# Altium schematic sheet HEADERS_JHAT.SchDoc: HEADERS JHAT
size A3; Author: Silvio Navaretti; CompanyName: ARDUINO; DrawnBy: Silvio Navaretti; Engineer: Silvio Navaretti; Organization: ARDUINO; SheetNumber: 20; SheetTotal: 51; RevAuthor: Silvio Navaretti
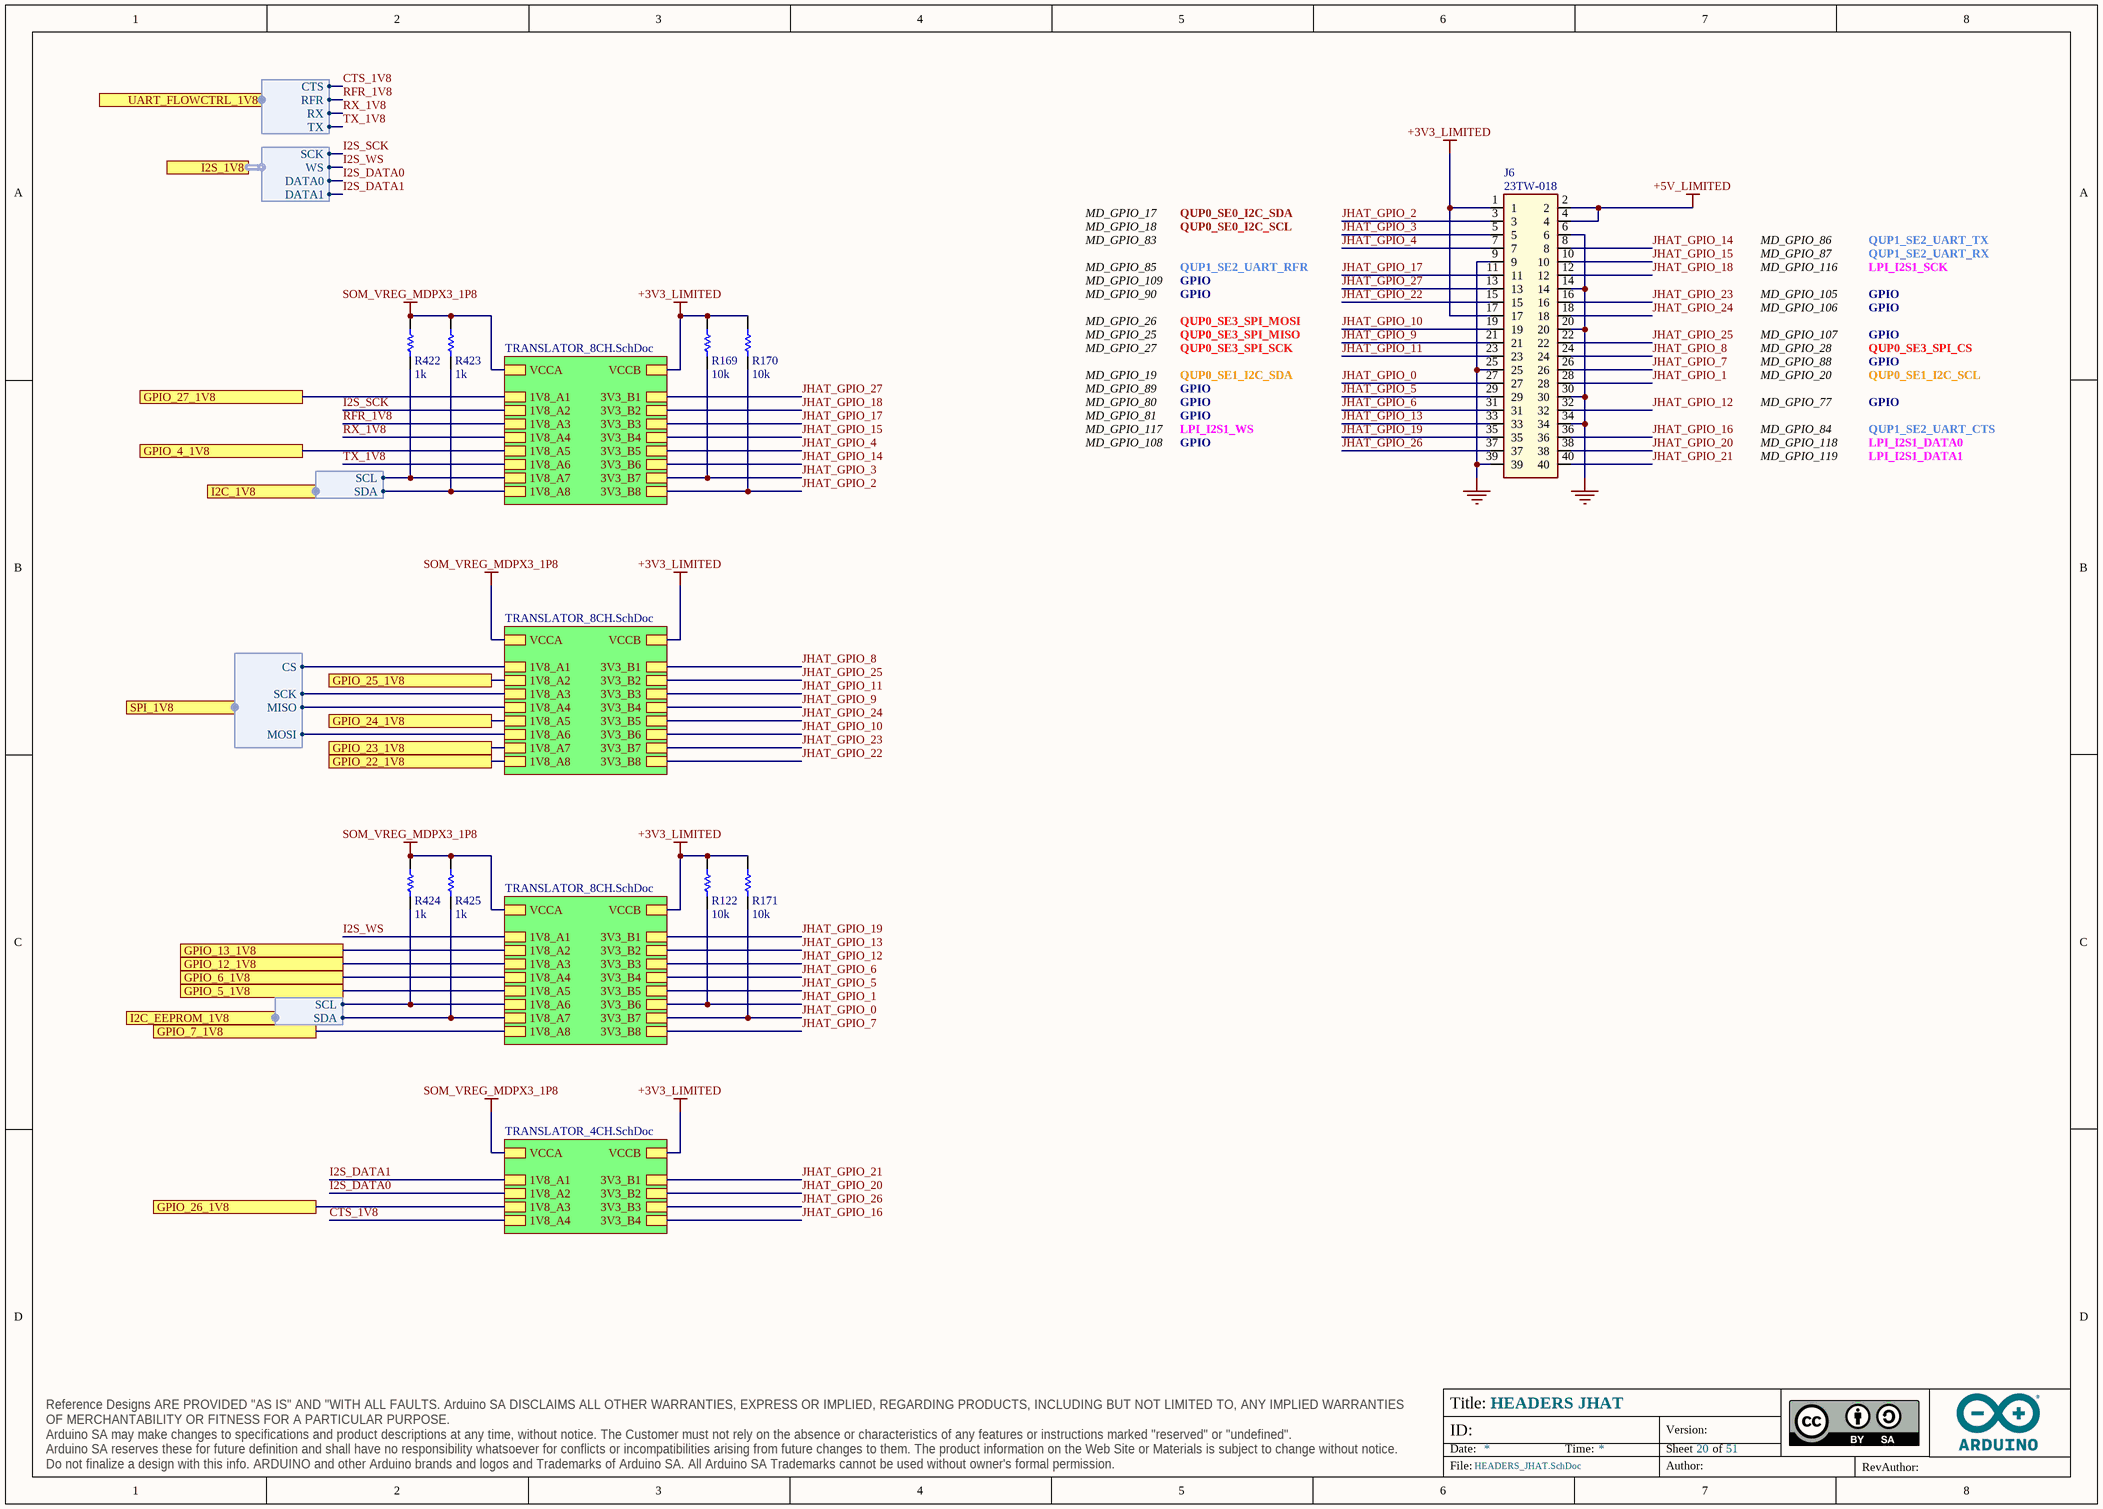
[diagram p0: HEADERS_JHAT.SchDoc]

## Parts
J6  23TW-018  [23TW-018]
R122  value 10k  [RES-0201]  (hidden comment: RC0201FR-0710KL)
R169  value 10k  [RES-0201]  (hidden comment: RC0201FR-0710KL)
R170  value 10k  [RES-0201]  (hidden comment: RC0201FR-0710KL)
R171  value 10k  [RES-0201]  (hidden comment: RC0201FR-0710KL)
R422  value 1k  [RES-0201]  (hidden comment: RC0201FR-071KL)
R423  value 1k  [RES-0201]  (hidden comment: RC0201FR-071KL)
R424  value 1k  [RES-0201]  (hidden comment: RC0201FR-071KL)
R425  value 1k  [RES-0201]  (hidden comment: RC0201FR-071KL)

## Sub-sheets
T8CH_ = TRANSLATOR_8CH.SchDoc: 1V8_A1, 1V8_A2, 1V8_A3, 1V8_A4, 1V8_A5, 1V8_A6, 1V8_A7, 1V8_A8, 3V3_B1, 3V3_B2, 3V3_B3, 3V3_B4, 3V3_B5, 3V3_B6, 3V3_B7, VCCA, VCCB, 3V3_B8
T8CH_ = TRANSLATOR_8CH.SchDoc: 1V8_A1, 1V8_A2, 1V8_A3, 1V8_A4, 1V8_A5, 1V8_A6, 1V8_A7, 1V8_A8, 3V3_B1, 3V3_B2, 3V3_B3, 3V3_B4, 3V3_B5, 3V3_B6, 3V3_B7, 3V3_B8, VCCA, VCCB
T8CH_ = TRANSLATOR_8CH.SchDoc: 1V8_A1, 1V8_A2, 1V8_A3, 1V8_A4, 1V8_A5, 1V8_A6, 1V8_A7, 1V8_A8, 3V3_B1, 3V3_B2, 3V3_B3, 3V3_B4, 3V3_B5, 3V3_B6, 3V3_B7, 3V3_B8, VCCA, VCCB
U_TRANSLATOR_4CH = TRANSLATOR_4CH.SchDoc: 1V8_A1, 1V8_A2, 1V8_A3, 1V8_A4, 3V3_B1, 3V3_B2, 3V3_B3, 3V3_B4, VCCA, VCCB

## Ports
GPIO_4_1V8, GPIO_5_1V8, GPIO_6_1V8, GPIO_7_1V8, GPIO_12_1V8, GPIO_13_1V8, GPIO_22_1V8, GPIO_23_1V8, GPIO_24_1V8, GPIO_25_1V8, GPIO_26_1V8, GPIO_27_1V8, I2C_1V8 (harness I2C), I2C_EEPROM_1V8 (harness I2C), I2S_1V8 (harness SOM_MD_I2S), SPI_1V8 (harness SPI), UART_FLOWCTRL_1V8 (harness SOM_MD_UART_FLCRTL)

## Harnesses
I2C: SDA, SCL
SPI: SCK, MISO, MOSI, CS
SOM_MD_UART_FLCRTL: TX, CTS, RFR, RX
SOM_MD_I2S: SCK, WS, DATA0, DATA1

## Nets
+3V3_LIMITED: J6.1 J6.17 R122.1 R169.1 R170.1 R171.1 ; sheet T8CH_/VCCB, sheet T8CH_/VCCB, sheet T8CH_/VCCB, sheet U_TRANSLATOR_4CH/VCCB
+5V_LIMITED: J6.2 J6.4
GND: J6.6 J6.9 J6.14 J6.20 J6.25 J6.30 J6.34 J6.39
SOM_VREG_MDPX3_1P8: R422.1 R423.1 R424.1 R425.1 ; sheet T8CH_/VCCA, sheet T8CH_/VCCA, sheet T8CH_/VCCA, sheet U_TRANSLATOR_4CH/VCCA
CTS_1V8: sheet U_TRANSLATOR_4CH/1V8_A4, port UART_FLOWCTRL_1V8.CTS
GPIO_4_1V8: port GPIO_4_1V8, sheet T8CH_/1V8_A5
GPIO_5_1V8: port GPIO_5_1V8, sheet T8CH_/1V8_A5
GPIO_6_1V8: port GPIO_6_1V8, sheet T8CH_/1V8_A4
GPIO_7_1V8: port GPIO_7_1V8, sheet T8CH_/1V8_A8
GPIO_12_1V8: port GPIO_12_1V8, sheet T8CH_/1V8_A3
GPIO_13_1V8: port GPIO_13_1V8, sheet T8CH_/1V8_A2
GPIO_22_1V8: port GPIO_22_1V8, sheet T8CH_/1V8_A8
GPIO_23_1V8: port GPIO_23_1V8, sheet T8CH_/1V8_A7
GPIO_24_1V8: port GPIO_24_1V8, sheet T8CH_/1V8_A5
GPIO_25_1V8: port GPIO_25_1V8, sheet T8CH_/1V8_A2
GPIO_26_1V8: port GPIO_26_1V8, sheet U_TRANSLATOR_4CH/1V8_A3
GPIO_27_1V8: port GPIO_27_1V8, sheet T8CH_/1V8_A1
I2S_DATA0: sheet U_TRANSLATOR_4CH/1V8_A2, port I2S_1V8.DATA0
I2S_DATA1: sheet U_TRANSLATOR_4CH/1V8_A1, port I2S_1V8.DATA1
I2S_SCK: sheet T8CH_/1V8_A2, port I2S_1V8.SCK
I2S_WS: sheet T8CH_/1V8_A1, port I2S_1V8.WS
JHAT_GPIO_0: J6.27 R171.2 ; sheet T8CH_/3V3_B7
JHAT_GPIO_1: J6.28 R122.2 ; sheet T8CH_/3V3_B6
JHAT_GPIO_2: J6.3 R170.2 ; sheet T8CH_/3V3_B8
JHAT_GPIO_3: J6.5 R169.2 ; sheet T8CH_/3V3_B7
JHAT_GPIO_4: J6.7 ; sheet T8CH_/3V3_B5
JHAT_GPIO_5: J6.29 ; sheet T8CH_/3V3_B5
JHAT_GPIO_6: J6.31 ; sheet T8CH_/3V3_B4
JHAT_GPIO_7: J6.26 ; sheet T8CH_/3V3_B8
JHAT_GPIO_8: J6.24 ; sheet T8CH_/3V3_B1
JHAT_GPIO_9: J6.21 ; sheet T8CH_/3V3_B4
JHAT_GPIO_10: J6.19 ; sheet T8CH_/3V3_B6
JHAT_GPIO_11: J6.23 ; sheet T8CH_/3V3_B3
JHAT_GPIO_12: J6.32 ; sheet T8CH_/3V3_B3
JHAT_GPIO_13: J6.33 ; sheet T8CH_/3V3_B2
JHAT_GPIO_14: J6.8 ; sheet T8CH_/3V3_B6
JHAT_GPIO_15: J6.10 ; sheet T8CH_/3V3_B4
JHAT_GPIO_16: J6.36 ; sheet U_TRANSLATOR_4CH/3V3_B4
JHAT_GPIO_17: J6.11 ; sheet T8CH_/3V3_B3
JHAT_GPIO_18: J6.12 ; sheet T8CH_/3V3_B2
JHAT_GPIO_19: J6.35 ; sheet T8CH_/3V3_B1
JHAT_GPIO_20: J6.38 ; sheet U_TRANSLATOR_4CH/3V3_B2
JHAT_GPIO_21: J6.40 ; sheet U_TRANSLATOR_4CH/3V3_B1
JHAT_GPIO_22: J6.15 ; sheet T8CH_/3V3_B8
JHAT_GPIO_23: J6.16 ; sheet T8CH_/3V3_B7
JHAT_GPIO_24: J6.18 ; sheet T8CH_/3V3_B5
JHAT_GPIO_25: J6.22 ; sheet T8CH_/3V3_B2
JHAT_GPIO_26: J6.37 ; sheet U_TRANSLATOR_4CH/3V3_B3
JHAT_GPIO_27: J6.13 ; sheet T8CH_/3V3_B1
RFR_1V8: sheet T8CH_/1V8_A3, port UART_FLOWCTRL_1V8.RFR
RX_1V8: sheet T8CH_/1V8_A4, port UART_FLOWCTRL_1V8.RX
TX_1V8: sheet T8CH_/1V8_A6, port UART_FLOWCTRL_1V8.TX
NetR422_2: R422.2 ; sheet T8CH_/1V8_A7, port I2C_1V8.SCL
NetR423_2: R423.2 ; sheet T8CH_/1V8_A8, port I2C_1V8.SDA
NetR424_2: R424.2 ; sheet T8CH_/1V8_A6, port I2C_EEPROM_1V8.SCL
NetR425_2: R425.2 ; sheet T8CH_/1V8_A7, port I2C_EEPROM_1V8.SDA
(unnamed): sheet T8CH_/1V8_A1, port SPI_1V8.CS
(unnamed): sheet T8CH_/1V8_A3, port SPI_1V8.SCK
(unnamed): sheet T8CH_/1V8_A4, port SPI_1V8.MISO
(unnamed): sheet T8CH_/1V8_A6, port SPI_1V8.MOSI

## Notes on the sheet
- MD_GPIO_17
- MD_GPIO_18
- MD_GPIO_83
- QUP0_SE0_I2C_SDA
- QUP0_SE0_I2C_SCL
- MD_GPIO_86
- QUP1_SE2_UART_TX
- MD_GPIO_85
- MD_GPIO_109
- MD_GPIO_90
- QUP1_SE2_UART_RFR
- GPIO
- MD_GPIO_87
- MD_GPIO_116
- MD_GPIO_105
- MD_GPIO_106
- QUP1_SE2_UART_RX
- LPI_I2S1_SCK
- MD_GPIO_26
- MD_GPIO_25
- MD_GPIO_27
- MD_GPIO_19
- QUP0_SE3_SPI_MOSI
- QUP0_SE3_SPI_MISO
- QUP0_SE3_SPI_SCK
- QUP0_SE1_I2C_SDA
- MD_GPIO_107
- MD_GPIO_28
- MD_GPIO_88
- MD_GPIO_20
- QUP0_SE3_SPI_CS
- QUP0_SE1_I2C_SCL
- MD_GPIO_89
- MD_GPIO_80
- MD_GPIO_81
- MD_GPIO_117
- MD_GPIO_108
- LPI_I2S1_WS
- MD_GPIO_77
- MD_GPIO_84
- MD_GPIO_118
- QUP1_SE2_UART_CTS
- LPI_I2S1_DATA0
- MD_GPIO_119
- LPI_I2S1_DATA1
- Title:
- ID:
- Date:
- Time:
- Version:
- Sheet
- of
- RevAuthor:
- Reference Designs ARE PROVIDED "AS IS" AND "WITH ALL FAULTS. Arduino SA DISCLAIMS ALL OTHER WARRANTIES, EXPRESS OR IMPLIED, REGARDING PRODUCTS, INCLUDING BUT NOT LIMITED TO, ANY IMPLIED WARRANTIES OF MERCHANTABILITY OR FITNESS FOR A PARTICULAR PURPOSE.
  Arduino SA may make changes to specifications and product descriptions at any time, without notice. The Customer must not rely on the absence or characteristics of any features or instructions marked "reserved" or "undefined".
  Arduino SA reserves these for future definition and shall have no responsibility whatsoever for conflicts or incompatibilities arising from future changes to them. The product information on the Web Site or Materials is subject to change without notice.
  Do not finalize a design with this info. ARDUINO and other Arduino brands and logos and Trademarks of Arduino SA. All Arduino SA Trademarks cannot be used without owner's formal permission.
- File:
- Author:

## Library data of the parts
J6 = J0572-A.1: CONN HEADER MALE 40POS 2x20 2.54mm SMD 6mm pin length; Manufacturer: 4UCONN; Code Arduino: J0572; Connector Type: BOARD CONNECTOR; Number of Contacts: 40; Part Number: 23TW-018; Termination: SMD/SMT; Insulation Color: Black; Contact Material: Gold
R122 R169-R171 = R0145-A.21: RES CHIP 0201 10k 1% 1/20W; Manufacturer: Yageo; Power: 50mW; Temperature coefficient: 200ppm; Code Arduino: R0145; Manufacturer 2: Samsung Electro-Mechanics; Tolerance: 1%; Case Code (Imperial): 0201; Part Number: RC0201FR-0710KL; Technology: Thick film
R422-R425 = R0195-A.22: RES CHIP 0201 1k 1% 1/20W; Manufacturer: Yageo; Power: 50mW; Temperature coefficient: 200ppm; Code Arduino: R0195; Tolerance: 1%; Case Code (Imperial): 0201; Part Number: RC0201FR-071KL; Technology: Thick film